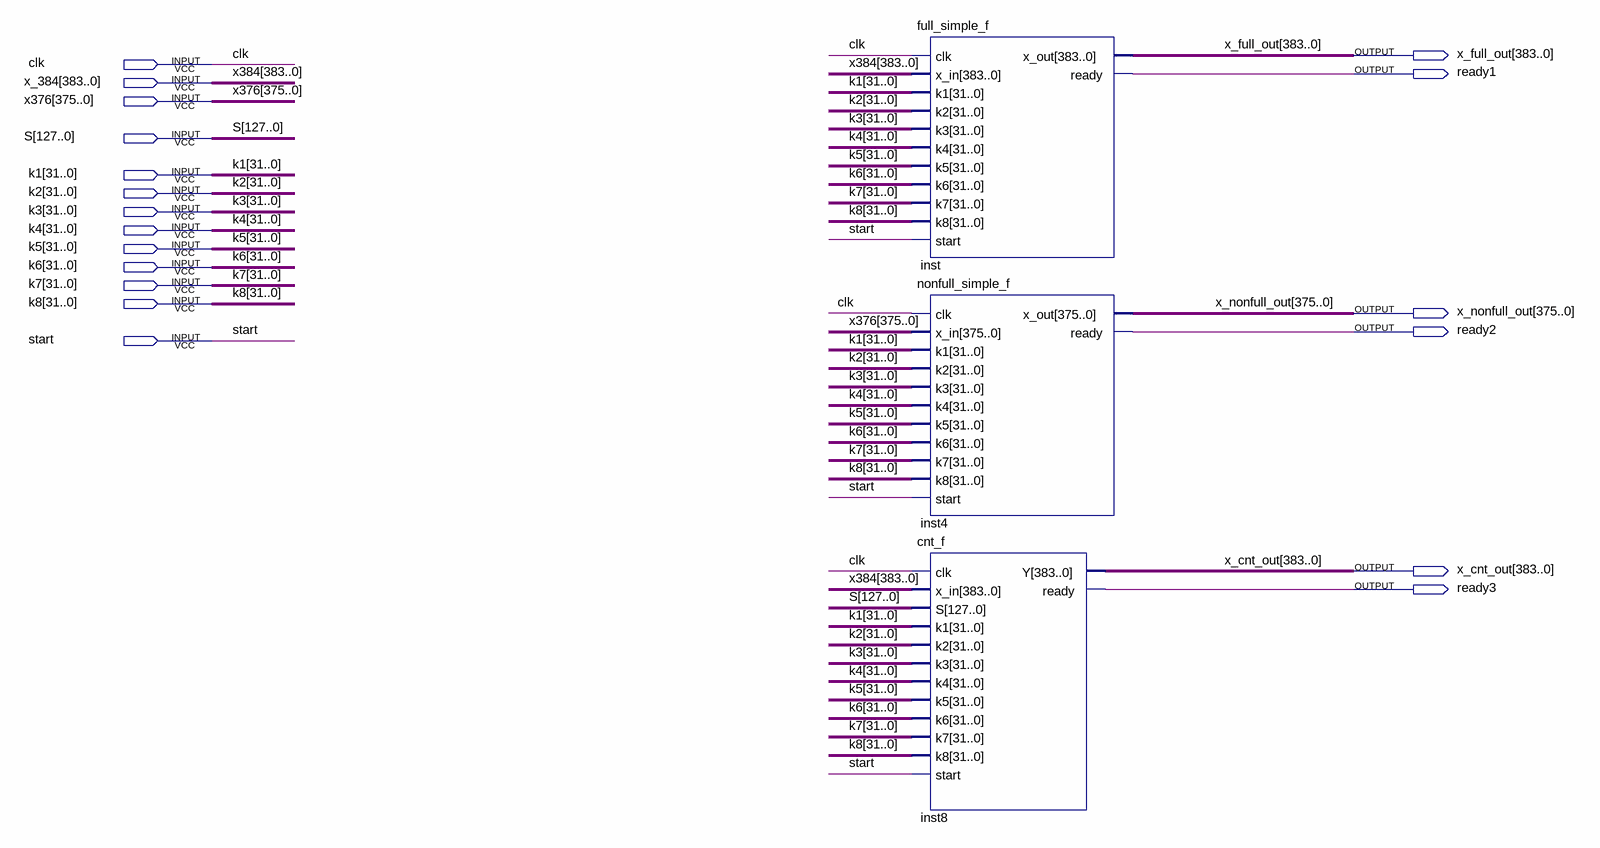
[diagram p0: schematic sheet]
// Quartus schematic BeIt.bdf as structural Verilog: 3 symbols, 19 pins
module BeIt (
  input  clk,
  input  [383:0] x_384,
  input  [375:0] x376,
  input  [127:0] S,
  input  [31:0] k1,
  input  [31:0] k2,
  input  [31:0] k3,
  input  [31:0] k4,
  input  [31:0] k5,
  input  [31:0] k6,
  input  [31:0] k7,
  input  [31:0] k8,
  input  start,
  output [383:0] x_full_out,
  output ready1,
  output [375:0] x_nonfull_out,
  output ready2,
  output [383:0] x_cnt_out,
  output ready3
);

  full_simple_f inst (
    .clk(clk), .x_in(x_384), .k1(k1), .k2(k2), .k3(k3), .k4(k4), .k5(k5), .k6(k6), .k7(k7), .k8(k8),
    .start(start), .x_out(x_full_out), .ready(ready1));
  nonfull_simple_f inst4 (
    .clk(clk), .x_in(x376), .k1(k1), .k2(k2), .k3(k3), .k4(k4), .k5(k5), .k6(k6), .k7(k7), .k8(k8),
    .start(start), .x_out(x_nonfull_out), .ready(ready2));
  cnt_f inst8 (
    .clk(clk), .x_in(x_384), .S(S), .k1(k1), .k2(k2), .k3(k3), .k4(k4), .k5(k5), .k6(k6), .k7(k7), .k8(k8),
    .start(start), .Y(x_cnt_out), .ready(ready3));

  // Other names for the same wires on the sheet: x384[383:0] = x_384
endmodule
